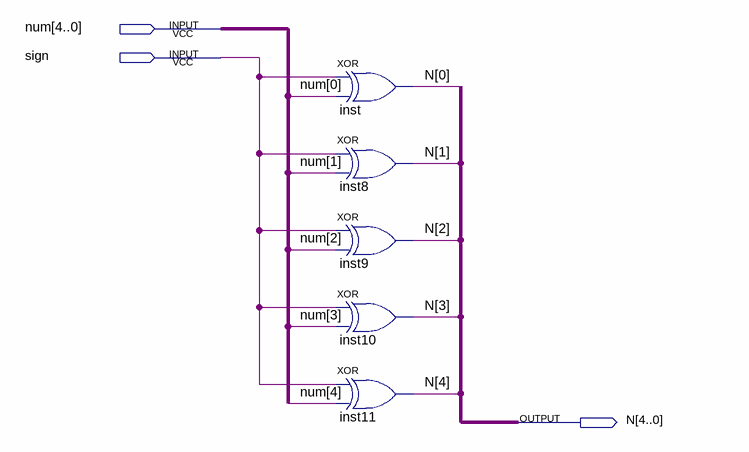
[diagram p0: schematic sheet]
// Quartus schematic INV.bdf as structural Verilog: 5 symbols, 3 pins
module INV (
  input  [4:0] num,
  input  sign,
  output [4:0] N
);

  xor inst (N[0], sign, num[0]);
  xor inst8 (N[1], sign, num[1]);
  xor inst9 (N[2], sign, num[2]);
  xor inst10 (N[3], sign, num[3]);
  xor inst11 (N[4], sign, num[4]);
endmodule
